# Altium project Temp_Sensor.PrjPcb
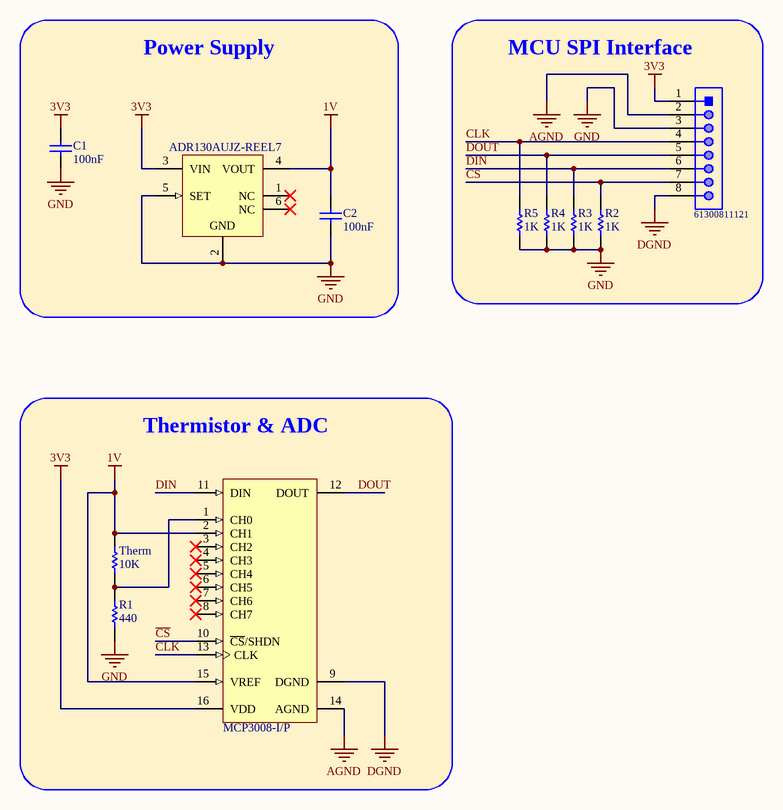
[diagram p0: TempSensor.SchDoc]
1 sheet, 11 parts. Net scope: global (net labels, ports and power ports of the same name join across sheets).
Board file: TempSensor.PcbDoc

## Sheet TempSensor.SchDoc: Temperature Sensor
size A; DrawnBy: Elliot Zuercher; Revision: A; SheetNumber: 1; SheetTotal: 1

### Parts
ADC  MCP3008-I/P  [PDIP300-P16]
C1  value 100nF  [RAD-0.3]  (hidden comment: Cap)
C2  value 100nF  [RAD-0.3]  (hidden comment: Cap)
Pins  61300811121  [61300811121]
R1  value 440  [AXIAL-0.3]  (hidden comment: Res1)
R2  value 1K  [AXIAL-0.3]  (hidden comment: Res1)
R3  value 1K  [AXIAL-0.3]  (hidden comment: Res1)
R4  value 1K  [AXIAL-0.3]  (hidden comment: Res1)
R5  value 1K  [AXIAL-0.3]  (hidden comment: Res1)
Therm  value 10K  [AXIAL-0.3]  (hidden comment: Thermistor)
Vref  ADR130AUJZ-REEL7  [ADI-UJ-6_M]

### Blocks framed on the sheet
Power Supply: C1 C2 Vref
MCU SPI Interface: Pins R2-R5
Thermistor & ADC: ADC R1 Therm

### Nets
1V: ADC.2(CH1) ADC.15(VREF) C2.2 Therm.2 Vref.4(VOUT)
3V3: ADC.16(VDD) C1.2 Pins.1 Vref.3(VIN)
AGND: ADC.14(AGND) Pins.2
DGND: ADC.9(DGND) Pins.8
GND: C1.1 C2.1 Pins.3 R1.1 R2.1 R3.1 R4.1 R5.1 Vref.2(GND) Vref.5(SET)
~{CS}: ADC.10(~{CS}/SHDN) Pins.7 R2.2
CLK: ADC.13(CLK) Pins.4 R5.2
DIN: ADC.11(DIN) Pins.6 R3.2
DOUT: ADC.12(DOUT) Pins.5 R4.2
NetADC_1: ADC.1(CH0) R1.2 Therm.1

Not connected (* = marked no-connect by the designer): ADC 3(CH2)* 4(CH3)* 5(CH4)* 6(CH5)* 7(CH6)* 8(CH7)*; Vref 1(NC)* 6(NC)*

### Library data of the parts
ADC = CMP-0188-00184-2: 2.7V 4-Channel/8-Channel 10-Bit A/D Converters with SPI Serial Interface, 16-Pin PDIP, Industrial Temperature; ComponentLink1URL: http://www.microchip.com/; ComponentLink2URL: http://ww1.microchip.com/downloads/en/DeviceDoc/21295d.pdf; PackageVersion: revBB, Aug-2009; ComponentLink3URL: http://www.microchip.com/stellent/groups/techpub_sg/documents/packagingspec/en012702.pdf; DatasheetVersion: revD, Dec-2008; PackageDescription: 16-Lead Plastic Dual In-Line (P) - 300 mil Body [PDIP]; ComponentLink3Description: Package Specification; Code_JEDEC: MS-001-BB; ComponentLink1Description: Manufacturer URL; RevisionNote: URLs added.; PackageReference: PDIP300-P16; ComponentLink2Description: Datasheet
C1 C2 = Cap: Capacitor; Published: 8-Jun-2000; LatestRevisionDate: 17-Jul-2002; LatestRevisionNote: Re-released for DXP Platform.; PackageReference: RAD-0.3; Publisher: Altium Limited; PackageDescription: Radial Cap, Thru-Hole; 2 Leads; 0.3 in Pin Spacing
Pins = CMP-1502-01076-1: THT Vertical Pin Header WR-PHD, Pitch 2.54 mm, Single Row, 8 pins; Manufacturer: Wurth Elektronik; Rated Current: 3A; Pin Number: 8; Working Voltage: 250VAC; Gender: Male; Contact Resistance: 20mOhm; Pitch: 2.54mm; Withstanding Voltage: 500VAC; Publisher: WurthElektronik; Operating Temperature: -40to105degC; Orientation: Vertical; Row Number: Single; Part Number: 61300811121; Package Reference: 61300811121; Mounting Technology: THT; Packaging: Bag; Manufacturer URL: http://www.we-online.de; Datasheet URL: https://katalog.we-online.de/em/datasheet/6130xx11121.pdf
R1-R5 = Res1: Resistor; Published: 8-Jun-2000; LatestRevisionDate: 17-Jul-2002; LatestRevisionNote: Re-released for DXP Platform.; PackageReference: AXIAL-0.3; Publisher: Altium Limited; PackageDescription: Axial Device, Thru-Hole; 2 Leads; 0.3 in Pin Spacing
Therm = Res1: Published: 8-Jun-2000; LatestRevisionDate: 17-Jul-2002; LatestRevisionNote: Re-released for DXP Platform.; PackageReference: AXIAL-0.3; Publisher: Altium Limited; PackageDescription: Axial Device, Thru-Hole; 2 Leads; 0.3 in Pin Spacing
Vref = CMP-0784-00541-1: Precision Series Sub-Band Gap Voltage Reference, 1 V Output, 2 to 18 V Supply, Industrial, 6-pin SOT23 (UJ-6), Reel; Manufacturer: Analog Devices; Ref Out TC (ppm/C): 15; Vout: 0.5V, 1V; Max V Supply (V): 18; Min V Supply (V): 2; PackageVersion: Dec-04; ComponentLink4URL: Product URL:http://www.analog.com/en/special-linear-functions/voltage-references/adr130/products/product.html; ComponentLink1Description: Manufacturer URL; ComponentLink2Description: Datasheet; DatasheetVersion: Rev. B; ComponentLink3Description: Package Specification; PackageDescription: 6-Pin Thin Small Outline Transistor Package, Body 2.9 x 1.6 mm, Pitch 0.95 mm; ComponentLink3URL: http://www.analog.com/static/imported-files/packages/PKG_PDF/TSOT(UJ)/UJ_6.pdf; Code_JEDEC: MO-193-AA; Mounting Technology: Surface Mount; ComponentLink1URL: http://www.analog.com/en/index.html; ComponentLink2URL: http://www.analog.com/static/imported-files/data_sheets/ADR130.pdf; Operating Temp Range: -40 to 125 degC; Packing: Reel; ComponentLink4Description: URL Link1; PartNumber: ADR130AUJZ-REEL7; PackageReference: UJ-6